# Altium project Motherboard.PrjPcb
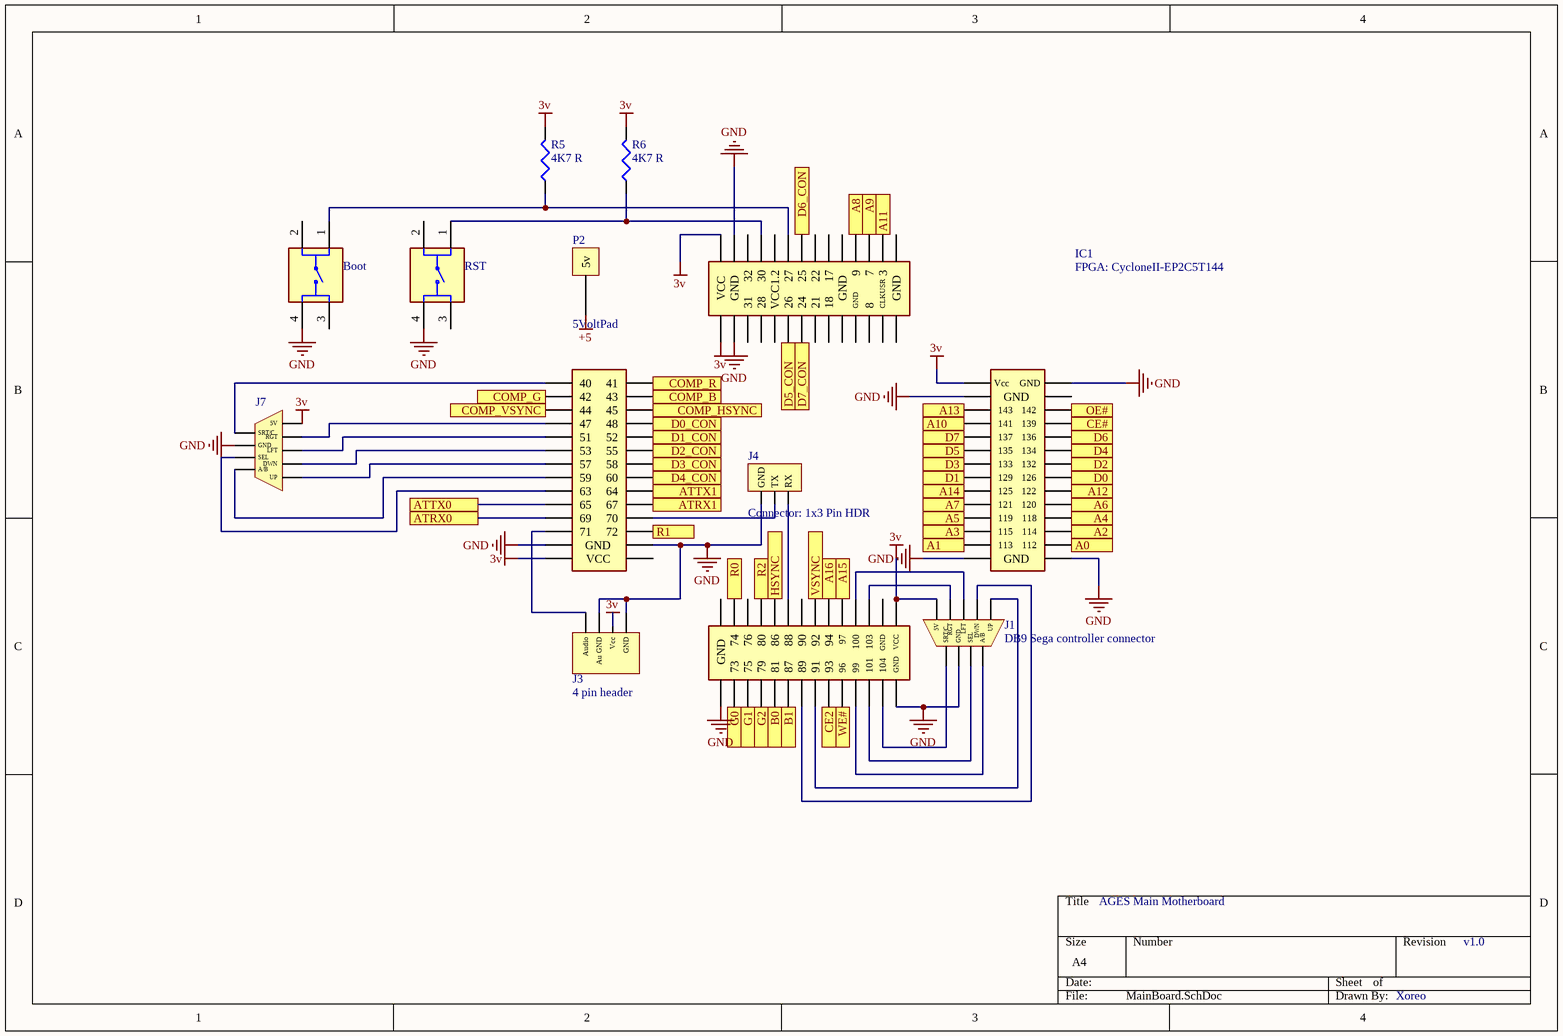
[diagram p0: MainBoard.SchDoc]
6 sheets, 38 parts. Net scope: flat (ports and power ports of the same name join across sheets).
Board file: AGES_PBC.PcbDoc
Sheets:
  MainBoard.SchDoc
  RAMConnection.SchDoc
  VGAConnection.SchDoc
  SDConnection.SchDoc
  CompositeConnection.SchDoc
  DebugLEDs.SchDoc

## Sheet MainBoard.SchDoc
size A4; SheetNumber: 1; SheetTotal: 6

### Parts
Boot  Button  [Button]  (value not drawn)
IC1  FPGA: CycloneII-EP2C5T144  [Cyclone II]
J1  DB9 Sega controller connector  [DB9 Connector]
J3  4 pin header  [4 HDR]
J4  Connector: 1x3 Pin HDR  [3 HDR]
J7  DB9 Sega controller connector  [DB9 Connector]  (value not drawn)
P2  5VoltPad  [5VoltPad]
R5  4K7 R  [Resistor 0603]
R6  4K7 R  [Resistor 0603]
RST  Button  [Button]  (value not drawn)

### Ports
A0, A1, A2, A3, A4, A5, A6, A7, A8, A9, A10, A11, A12, A13, A14, A15, A16, ATRX0, ATRX1, ATTX0, ATTX1, B0, B1, CE2, CE#, COMP_B, COMP_G, COMP_HSYNC, COMP_R, COMP_VSYNC, D0, D0_CON, D1, D1_CON, D2, D2_CON, D3, D3_CON, D4, D4_CON, D5, D5_CON, D6, D6_CON, D7, D7_CON, G0, G1, G2, HSYNC, OE#, R0, R1, R2, VSYNC, WE#

### Nets
3v: IC1.27(VCC) IC1.28(VCC) IC1.55 IC1.57(VCC) IC1.86(Vcc) J1.5(5V) J3.2(Vcc) J7.5(5V) R5.2 R6.2
+5: P2.1(5v)
GND: Boot.4 IC1.25(GND) IC1.26(GND) IC1.53 IC1.54(GND) IC1.58(GND) IC1.84(GND) IC1.85(GND) IC1.88 IC1.111(GND) IC1.112 J1.8(GND) J3.1(GND) J3.3(Au_GND) J4.1(GND) J7.8(GND) RST.4
NetBoot_1: Boot.1 IC1.17(27) R5.1
NetIC1_3: IC1.3 ; port A11
NetIC1_5: IC1.5(7) ; port A9
NetIC1_7: IC1.7(9) ; port A8
NetIC1_15: IC1.15(25) ; port D6_CON
NetIC1_16: IC1.16(24) ; port D7_CON
NetIC1_18: IC1.18(26) ; port D5_CON
NetIC1_21: IC1.21(30) R6.1 RST.1
NetIC1_29: IC1.29(40) J7.9(SRT/C)
NetIC1_30: IC1.30(41) ; port COMP_R
NetIC1_31: IC1.31(42) ; port COMP_G
NetIC1_32: IC1.32(43) ; port COMP_B
NetIC1_33: IC1.33(44) ; port COMP_VSYNC
NetIC1_34: IC1.34(45) ; port COMP_HSYNC
NetIC1_35: IC1.35(47) J7.4(RGT)
NetIC1_36: IC1.36(48) ; port D0_CON
NetIC1_37: IC1.37(51) J7.3(LFT)
NetIC1_38: IC1.38(52) ; port D1_CON
NetIC1_39: IC1.39(53) J7.2(DWN)
NetIC1_40: IC1.40(55) ; port D2_CON
NetIC1_41: IC1.41(57) J7.1(UP)
NetIC1_42: IC1.42(58) ; port D3_CON
NetIC1_43: IC1.43(59) J7.6(A/B)
NetIC1_44: IC1.44(60) ; port D4_CON
NetIC1_45: IC1.45(63) J7.7(SEL)
NetIC1_46: IC1.46(64) ; port ATTX1
NetIC1_47: IC1.47(65) ; port ATTX0
NetIC1_48: IC1.48(67) ; port ATRX1
NetIC1_49: IC1.49(69) ; port ATRX0
NetIC1_50: IC1.50(70) J4.2(TX)
NetIC1_51: IC1.51(71) J3.4(Audio)
NetIC1_52: IC1.52(72) ; port R1
NetIC1_60: IC1.60(104) J1.9(SRT/C)
NetIC1_61: IC1.61(103) J1.4(RGT)
NetIC1_62: IC1.62(101) J1.7(SEL)
NetIC1_63: IC1.63(100) J1.3(LFT)
NetIC1_64: IC1.64(99) J1.6(A/B)
NetIC1_65: IC1.65(97) ; port A15
NetIC1_66: IC1.66(96) ; port WE#
NetIC1_67: IC1.67(94) ; port A16
NetIC1_68: IC1.68(93) ; port CE2
NetIC1_69: IC1.69(92) ; port VSYNC
NetIC1_70: IC1.70(91) J1.1(UP)
NetIC1_72: IC1.72(89) J1.2(DWN)
NetIC1_73: IC1.73(88) J4.3(RX)
NetIC1_74: IC1.74(87) ; port B1
NetIC1_75: IC1.75(86) ; port HSYNC
NetIC1_76: IC1.76(81) ; port B0
NetIC1_77: IC1.77(80) ; port R2
NetIC1_78: IC1.78(79) ; port G2
NetIC1_80: IC1.80(75) ; port G1
NetIC1_81: IC1.81(74) ; port R0
NetIC1_82: IC1.82(73) ; port G0
NetIC1_89: IC1.89(142) ; port OE#
NetIC1_90: IC1.90(143) ; port A13
NetIC1_91: IC1.91(139) ; port CE#
NetIC1_92: IC1.92(141) ; port A10
NetIC1_93: IC1.93(136) ; port D6
NetIC1_94: IC1.94(137) ; port D7
NetIC1_95: IC1.95(134) ; port D4
NetIC1_96: IC1.96(135) ; port D5
NetIC1_97: IC1.97(132) ; port D2
NetIC1_98: IC1.98(133) ; port D3
NetIC1_99: IC1.99(126) ; port D0
NetIC1_100: IC1.100(129) ; port D1
NetIC1_101: IC1.101(122) ; port A12
NetIC1_102: IC1.102(125) ; port A14
NetIC1_103: IC1.103(120) ; port A6
NetIC1_104: IC1.104(121) ; port A7
NetIC1_105: IC1.105(118) ; port A4
NetIC1_106: IC1.106(119) ; port A5
NetIC1_107: IC1.107(114) ; port A2
NetIC1_108: IC1.108(115) ; port A3
NetIC1_109: IC1.109(112) ; port A0
NetIC1_110: IC1.110(113) ; port A1

Not connected (* = marked no-connect by the designer): Boot 2 3; IC1 1(GND) 2(GND) 4(CLKUSR) 6(8) 8(GND) 9(GND) 10(GND) 11(17) 12(18) 13(22) 14(21) 19(VCC1.2) 20(VCC1.2) 22(28) 23(32) 24(31) 56(VCC) 59(GND) 71(90) 79(76) 83(VCC) 87(GND); RST 2 3

### Notes on the sheet
- AGES Main Motherboard
- v1.0
- Xoreo

### Library data of the parts
Boot RST = Button: 50 mA SPST Round Actuator 160 Gram Force Tactile Pushbutton Switch; MP: 1825910-2; MF: TE Connectivity; Check_prices: https://www.snapeda.com/parts/1825910-2/TE+Connectivity+ALCOSWITCH+Switches/view-part/?ref=eda; Value: *; Availability: In Stock; Price: None; Package: None; SnapEDA_Link: https://www.snapeda.com/parts/1825910-2/TE+Connectivity+ALCOSWITCH+Switches/view-part/?ref=snap; Purchase-URL: https://pricing.snapeda.com/search/part/1825910-2/?ref=eda; EU_RoHS_Compliance: Compliant
J1 J7 = Connector: DB9: 9 Way Right Angle Through Hole PCB D-sub Connector Socket; 2.77mm; 2.84mm Pitch; Manufacturer: Wurth Electronics; Manufacturer Part Number: 618009231321; Gender: Female; Current Rating: 3A; Number of Contacts: 9; Voltage Rating: 125V; Supplier 1: Farnell; RoHS: Yes; Category: D-Sub Connectors; Stock 1: 287; Pricing 1: 1=3,44000, 10=2,90000, 100=2,52000, 250=2,17000, 500=1,93000, 1000=1,89000 (EUR); Mount: Through Hole; Contact Material: Copper Alloy; Contact Plating: Gold; Housing Material: Steel; Min Operating Temperature: -40°C; Max Operating Temperature: 85°C; Series: 618; Number of Rows: 2; Termination: SMD/SMT; Orientation: Right Angle; Length: 30.8mm; Width: 12.5mm; Depth: 20.75mm; Pitch: 2.84mm; RoHS Compliant: Yes; Lead Free: Lead Free; ComponentLink1URL: https://datasheet.ciiva.com/25605/0900766b81191772-25605489.pdf?src-supplier=Rs; ComponentLink1Description: https://datasheet.ciiva.com/25605/0900766b81191772-25605489.pdf?src-supplier=Rs; ComponentLink2URL: https://datasheet.ciiva.com/12669/6180xx231321-12669192.pdf?src-supplier=Mouser; ComponentLink2Description: https://datasheet.ciiva.com/12669/6180xx231321-12669192.pdf?src-supplier=Mouser; Supplier Part Number 1: 1841197
J3 = Connector: 4 pin header: Male 4 pin header
R5 R6 = Resistor: 4K7: Surface Mount Metal Film Resistor, Pcf Series, 4.7 Kohm, 63 Mw, - 0.1%, 75 V Rohs Compliant: Yes; Manufacturer: TT Welwyn; Manufacturer Part Number: PCF0603P-R-4K7-BT1; Power Rating: 63mW; Voltage Rating: 75V; Resistance: 4.7kR; Temperature Coefficient: 25ppm/°C; Case/Category: 0603; Supplier 1: Newark; RoHS: Yes; Category: Chip SMD Resistors; Stock 1: 1027; Pricing 1: 10=0,17900 (USD); Case Code (Imperial): 0603; Case Code (Metric): 1608; Tolerance: 0.1%; Packaging: Cut Tape; Resistor Type: Thin Film; Voltage Rating (DC): 75V; REACH SVHC: No SVHC; ComponentLink1URL: https://datasheet.ciiva.com/7860/3754-7860191.pdf?src-supplier=Element14; ComponentLink1Description: https://datasheet.ciiva.com/7860/3754-7860191.pdf?src-supplier=Element14; ComponentLink2URL: https://datasheet.ciiva.com/6093/3754-6093381.pdf?src-supplier=Farnell; ComponentLink2Description: https://datasheet.ciiva.com/6093/3754-6093381.pdf?src-supplier=Farnell; Supplier Part Number 1: 61M8292

## Sheet RAMConnection.SchDoc
size A4; SheetNumber: 2; SheetTotal: 6
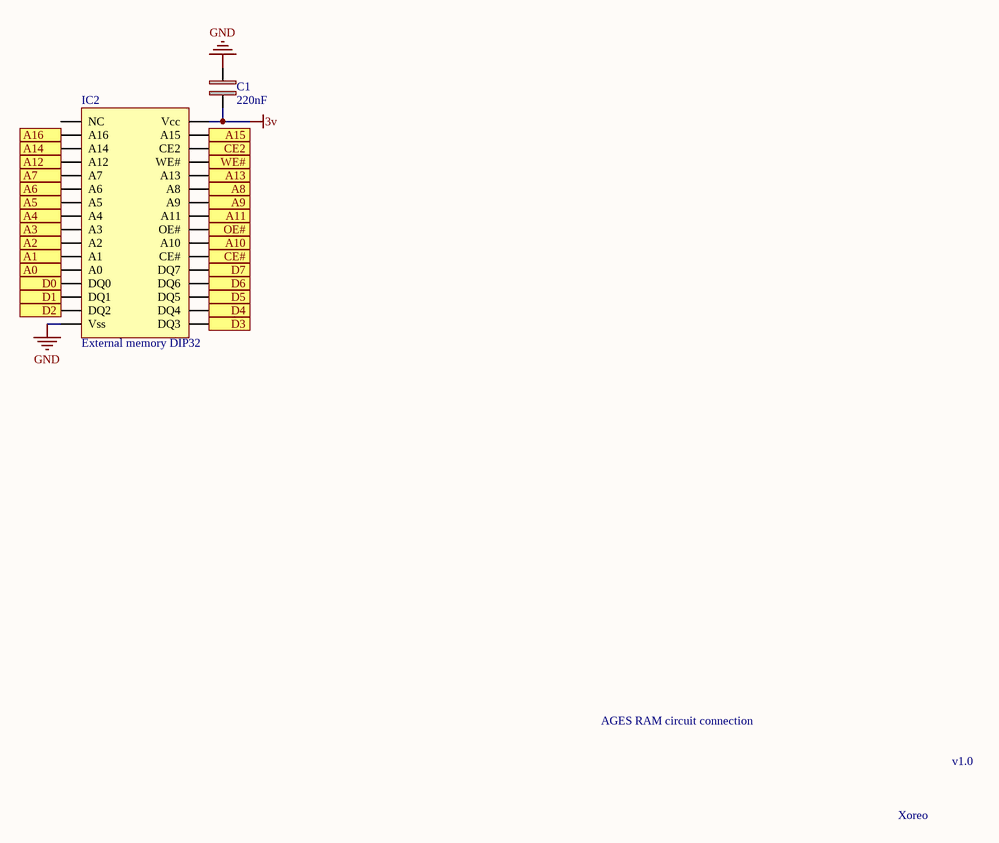
[diagram p1: RAMConnection.SchDoc]

### Parts
C1  220nF  [C0805C224K5RACTU]
IC2  External memory DIP32  [DIP32 HDR]

### Ports
A0, A1, A2, A3, A4, A5, A6, A7, A8, A9, A10, A11, A12, A13, A14, A15, A16, CE2, CE#, D0, D1, D2, D3, D4, D5, D6, D7, OE#, WE#

### Nets
3v: C1.2 IC2.32(Vcc)
GND: C1.1 IC2.16(Vss)
NetIC1_3: IC2.25(A11) ; port A11
NetIC1_5: IC2.26(A9) ; port A9
NetIC1_7: IC2.27(A8) ; port A8
NetIC1_65: IC2.31(A15) ; port A15
NetIC1_66: IC2.29(WE#) ; port WE#
NetIC1_67: IC2.2(A16) ; port A16
NetIC1_68: IC2.30(CE2) ; port CE2
NetIC1_89: IC2.24(OE#) ; port OE#
NetIC1_90: IC2.28(A13) ; port A13
NetIC1_91: IC2.22(CE#) ; port CE#
NetIC1_92: IC2.23(A10) ; port A10
NetIC1_93: IC2.20(DQ6) ; port D6
NetIC1_94: IC2.21(DQ7) ; port D7
NetIC1_95: IC2.18(DQ4) ; port D4
NetIC1_96: IC2.19(DQ5) ; port D5
NetIC1_97: IC2.15(DQ2) ; port D2
NetIC1_98: IC2.17(DQ3) ; port D3
NetIC1_99: IC2.13(DQ0) ; port D0
NetIC1_100: IC2.14(DQ1) ; port D1
NetIC1_101: IC2.4(A12) ; port A12
NetIC1_102: IC2.3(A14) ; port A14
NetIC1_103: IC2.6(A6) ; port A6
NetIC1_104: IC2.5(A7) ; port A7
NetIC1_105: IC2.8(A4) ; port A4
NetIC1_106: IC2.7(A5) ; port A5
NetIC1_107: IC2.10(A2) ; port A2
NetIC1_108: IC2.9(A3) ; port A3
NetIC1_109: IC2.12(A0) ; port A0
NetIC1_110: IC2.11(A1) ; port A1

Not connected (* = marked no-connect by the designer): IC2 1(NC)

### Notes on the sheet
- AGES RAM circuit connection
- v1.0
- Xoreo

### Library data of the parts
C1 = Capacitor: 0.22µF: 0805 C 220nF Ceramic Multilayer Capacitor; 50 VDC; +125degC; X7R Dielec; +/-10%; Manufacturer: KEMET; Voltage Rating: 50V; Tolerance: 10%; Dissipation Factor: 2.5%; Supplier 1: RSComponents; Manufacturer Part Number: C0805C224K5RACTU; RoHS: Yes; Category: Ceramic Capacitors; Stock 1: 18500; Pricing 1: 500=0,04800, 2500=0,03900 (USD); Mount: Surface Mount,PCB; Case/Package: 0805; Case Code (Metric): 2012; Case Code (Imperial): 0805; Dielectric Material: Ceramic; Min Operating Temperature: -55°C; Max Operating Temperature: 125°C; Package Quantity: 1; Capacitance: 220nF; Packaging: Tape and Reel; Voltage Rating (DC): 50V; Dielectric: X7R; Termination: SMD/SMT; Voltage: 50V; Series: C; Construction: Flat; Length: 2mm; Width: 0.049inch; Height: 1.1mm; Thickness: 0.055inch; Lead Pitch: 0.75mm; Depth: 1.25mm; Radiation Hardening: No; REACH SVHC: No SVHC; RoHS Compliant: Yes; ComponentLink1URL: https://datasheet.ciiva.com/7842/kem-c1002-x7r-smd-7842582.pdf?src-supplier=Element14; ComponentLink1Description: https://datasheet.ciiva.com/7842/kem-c1002-x7r-smd-7842582.pdf?src-supplier=Element14; ComponentLink2URL: https://datasheet.ciiva.com/18193/getdatasheetpartid-304413-18193686.pdf?src-supplier=Verical; ComponentLink2Description: https://datasheet.ciiva.com/18193/getdatasheetpartid-304413-18193686.pdf?src-supplier=Verical; Supplier Part Number 1: 8029927
IC2 = IC: AS6C1008: AS6C1008 Series 1-Mbit (128 K x 8) 3 V 55 ns CMOS Static RAM - PDIP-32; Manufacturer: Alliance Memory; Manufacturer Part Number: AS6C1008-55PCN; Access Time: 55ns; Max Supply Voltage: 5.5V; Min Supply Voltage: 2.7V; Interface: Parallel; Memory Size: 1Mb; Memory Type: RAM,SRAM - Asynchronous,SDR; Operating Supply Voltage: 3V; Address Bus Width: 17b; Number of Ports: 1; Number of Words: 128000; Max Supply Current: 60mA; Supplier 1: Rs; RoHS: Yes; Category: RAM; Stock 1: 774; Pricing 1: 1=4,11000, 5=3,49000, 10=3,39000, 25=3,28000, 50=3,20000 (EUR); Mount: Through Hole; Case/Package: PDIP; Number of Pins: 32; Weight: 0.078125oz; Min Operating Temperature: 0°C; Max Operating Temperature: 70°C; Packaging: Rail/Tube; Package Quantity: 13; Series: AS6C1008; Density: 1Mb; Access Time-Max: 55ns; Supply Voltage-Nom: 3V; Length: 41.91mm; Width: 13.818mm; Height: 3.81mm; Radiation Hardening: No; RoHS Compliant: Yes; Lead Free: Lead Free; Temperature Grade: COMMERCIAL; Reach SVHC Compliant: Yes; ComponentLink1URL: https://datasheet.ciiva.com/19457/1927457-19457052.pdf?src-supplier=Jameco; ComponentLink1Description: https://datasheet.ciiva.com/19457/1927457-19457052.pdf?src-supplier=Jameco; ComponentLink2URL: https://datasheet.ciiva.com/6877/32783-6877594.pdf?src-supplier=Newark; ComponentLink2Description: https://datasheet.ciiva.com/6877/32783-6877594.pdf?src-supplier=Newark; ComponentLink3URL: https://datasheet.ciiva.com/18617/as6c1008feb2007-18617960.pdf?src-supplier=Digi-Key; ComponentLink3Description: https://datasheet.ciiva.com/18617/as6c1008feb2007-18617960.pdf?src-supplier=Digi-Key; ComponentLink4URL: https://datasheet.ciiva.com/1510/32783-1510620.pdf?src-supplier=Element14; ComponentLink4Description: https://datasheet.ciiva.com/1510/32783-1510620.pdf?src-supplier=Element14; ComponentLink5URL: https://datasheet.ciiva.com/3201/as6c1008feb2007-3201030.pdf?src-supplier=Avnet; ComponentLink5Description: https://datasheet.ciiva.com/3201/as6c1008feb2007-3201030.pdf?src-supplier=Avnet; ComponentLink6URL: https://datasheet.ciiva.com/16208/as6c1008feb2007-16208749.pdf?src-supplier=Future+Electronics; ComponentLink6Description: https://datasheet.ciiva.com/16208/as6c1008feb2007-16208749.pdf?src-supplier=Future+Electronics; Supplier Part Number 1: 7444542

## Sheet VGAConnection.SchDoc
size A4; SheetNumber: 3; SheetTotal: 6
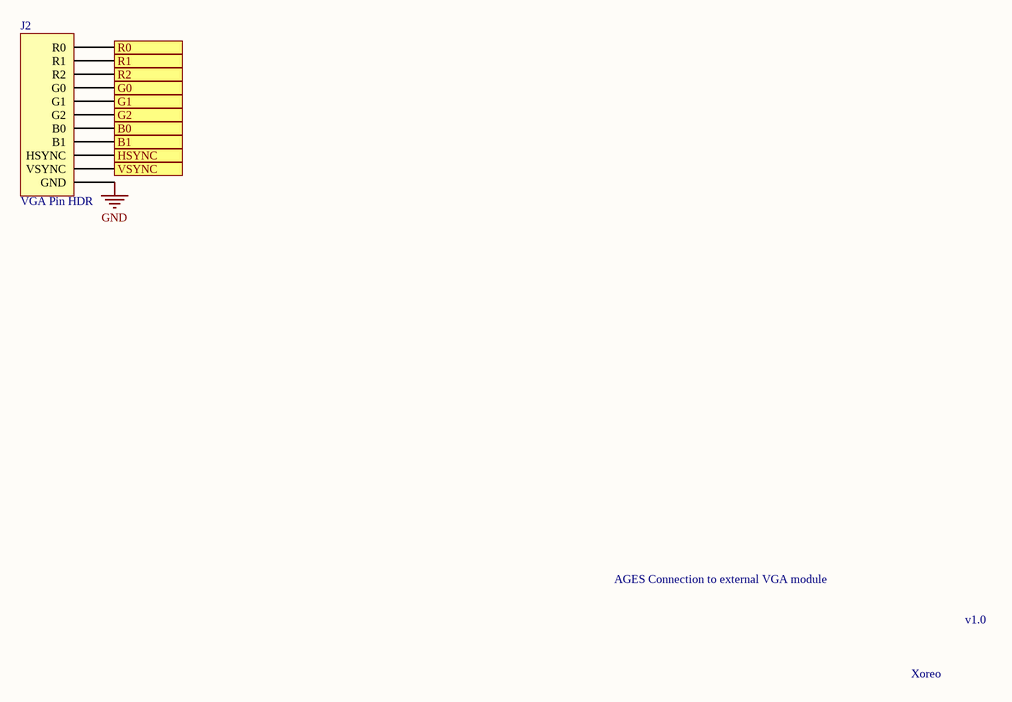
[diagram p2: VGAConnection.SchDoc]

### Parts
J2  VGA Pin HDR  [VGA HDR]

### Ports
B0, B1, G0, G1, G2, HSYNC, R0, R1, R2, VSYNC

### Nets
GND: J2.11(GND)
NetIC1_52: J2.2(R1) ; port R1
NetIC1_69: J2.10(VSYNC) ; port VSYNC
NetIC1_74: J2.8(B1) ; port B1
NetIC1_75: J2.9(HSYNC) ; port HSYNC
NetIC1_76: J2.7(B0) ; port B0
NetIC1_77: J2.3(R2) ; port R2
NetIC1_78: J2.6(G2) ; port G2
NetIC1_80: J2.5(G1) ; port G1
NetIC1_81: J2.1(R0) ; port R0
NetIC1_82: J2.4(G0) ; port G0

### Notes on the sheet
- AGES Connection to external VGA module
- v1.0
- Xoreo

### Library data of the parts
J2 = Connector: VGA HDR: VGA pin male header

## Sheet SDConnection.SchDoc
size A4; SheetNumber: 4; SheetTotal: 6
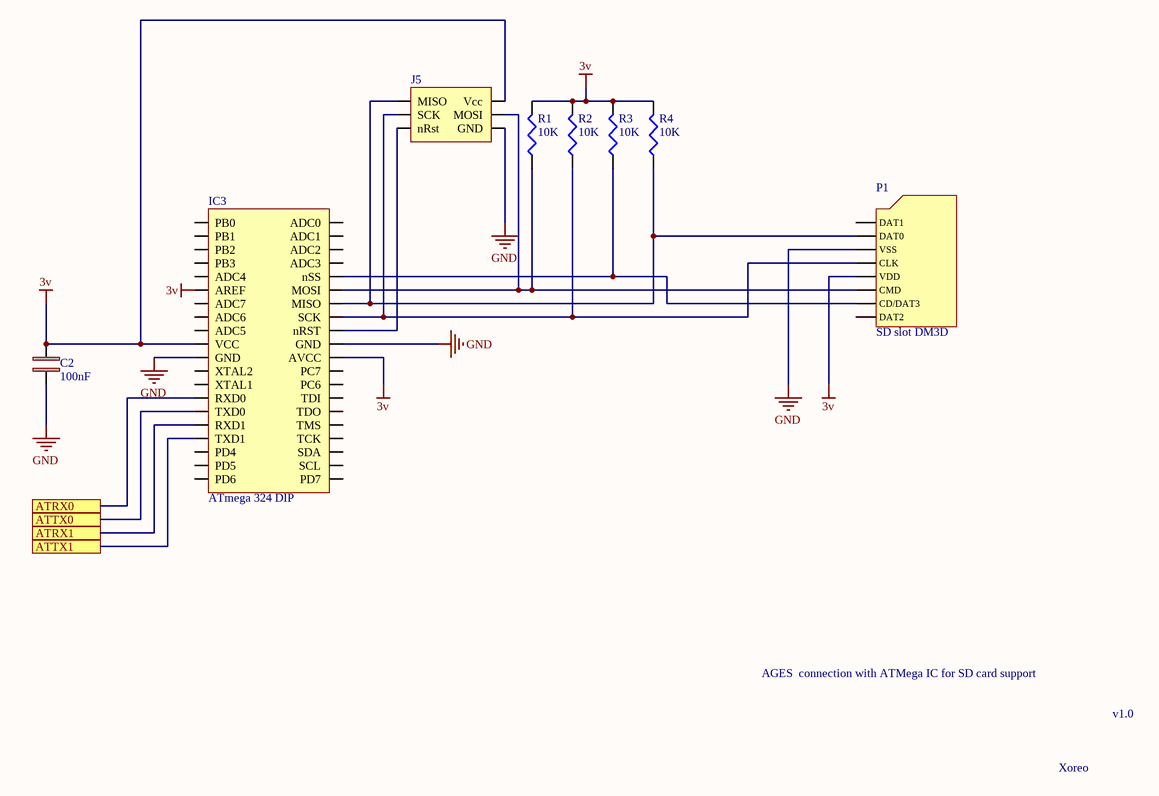
[diagram p3: SDConnection.SchDoc]

### Parts
C2  100nF  [CAPACITOR 1206]
IC3  ATmega 324 DIP  [DIP40 HDR]
J5  2x3 male pin header  [2X3 HDR]  (value not drawn)
P1  SD slot DM3D  [SD SLOT]
R1  10K  [RESISTOR 0805]
R2  10K  [RESISTOR 0805]
R3  10K  [RESISTOR 0805]
R4  10K  [RESISTOR 0805]

### Ports
ATRX0, ATRX1, ATTX0, ATTX1

### Nets
3v: C2.1 IC3.10(VCC) IC3.30(AVCC) IC3.32(AREF) J5.2(Vcc) P1.4(VDD) R1.2 R2.2 R3.2 R4.2
GND: C2.2 IC3.11(GND) IC3.31(GND) J5.6(GND) P1.6(VSS)
NetIC1_46: IC3.17(TXD1) ; port ATTX1
NetIC1_47: IC3.15(TXD0) ; port ATTX0
NetIC1_48: IC3.16(RXD1) ; port ATRX1
NetIC1_49: IC3.14(RXD0) ; port ATRX0
NetIC3_5: IC3.5(nSS) P1.2(CD/DAT3) R3.1
NetIC3_6: IC3.6(MOSI) J5.4(MOSI) P1.3(CMD) R1.1
NetIC3_7: IC3.7(MISO) J5.1(MISO) P1.7(DAT0) R4.1
NetIC3_8: IC3.8(SCK) J5.3(SCK) P1.5(CLK) R2.1
NetIC3_9: IC3.9(nRST) J5.5(nRst)

Not connected (* = marked no-connect by the designer): IC3 1(PB0) 2(PB1) 3(PB2) 4(PB3) 12(XTAL2) 13(XTAL1) 18(PD4) 19(PD5) 20(PD6) 21(PD7) 22(SCL) 23(SDA) 24(TCK) 25(TMS) 26(TDO) 27(TDI) 28(PC6) 29(PC7) 33(ADC7) 34(ADC6) 35(ADC5) 36(ADC4) 37(ADC3) 38(ADC2) 39(ADC1) 40(ADC0); P1 1(DAT2) 8(DAT1)

### Notes on the sheet
- AGES  connection with ATMega IC for SD card support
- v1.0
- Xoreo

### Library data of the parts
C2 = Capacitor: 100nF: Ceramic capacitor SMD-1206 100nF /50V X7R# K +-10%, AVX, RoHS, /4000 reel/; Manufacturer: Kyocera AVX; Manufacturer Part Number: 12065C104KAT2A; Tolerance: 10%; Voltage Rating: 50V; Dielectric: X7R; Insulation Resistance: 100GR; Dissipation Factor: 2.5%; Supplier 1: Farnell; RoHS: Yes; Category: Ceramic Capacitors; Stock 1: 188000; Pricing 1: 4000=0,02600, 20000=0,02520, 40000=0,02440 (EUR); Mount: Surface Mount,PCB; Case/Package: 1206; Number of Pins: 2; Case Code (Metric): 3216; Case Code (Imperial): 1206; Dielectric Material: Ceramic; Contact Plating: Tin,Matte; Min Operating Temperature: -55°C; Max Operating Temperature: 125°C; Packaging: Tape and Reel; Capacitance: 100nF; Voltage Rating (DC): 50V; Voltage: 50V; Series: -; Package Quantity: 1; Termination: SMD/SMT; Construction: Flat; Length: 3.2mm; Width: 1.6mm; Height: 0.94mm; Depth: 1.6mm; Thickness: 0.037inch; Radiation Hardening: No; Lead Free: Lead Free; RoHS Compliant: Yes; Reach SVHC Compliant: Yes; ComponentLink1URL: https://datasheet.ciiva.com/11786/0900766b80ed4be2-11786988.pdf?src-supplier=Rs; ComponentLink1Description: https://datasheet.ciiva.com/11786/0900766b80ed4be2-11786988.pdf?src-supplier=Rs; ComponentLink2URL: https://datasheet.ciiva.com/2988/cx7r-2988135.pdf?src-supplier=Avnet; ComponentLink2Description: https://datasheet.ciiva.com/2988/cx7r-2988135.pdf?src-supplier=Avnet; ComponentLink3URL: https://datasheet.ciiva.com/16375/cx7r-16375719.pdf?src-supplier=Future+Electronics; ComponentLink3Description: https://datasheet.ciiva.com/16375/cx7r-16375719.pdf?src-supplier=Future+Electronics; ComponentLink4URL: https://datasheet.ciiva.com/2988/cx7r-2988136.pdf?src-supplier=Avnet; ComponentLink4Description: https://datasheet.ciiva.com/2988/cx7r-2988136.pdf?src-supplier=Avnet; ComponentLink5URL: https://datasheet.ciiva.com/7833/cx7r-7833405.pdf?src-supplier=Element14; ComponentLink5Description: https://datasheet.ciiva.com/7833/cx7r-7833405.pdf?src-supplier=Element14; ComponentLink6URL: https://datasheet.ciiva.com/25796/cx7r-25796358.pdf?src-supplier=Farnell; ComponentLink6Description: https://datasheet.ciiva.com/25796/cx7r-25796358.pdf?src-supplier=Farnell; ComponentLink7URL: https://datasheet.ciiva.com/7833/cx7r-7833402.pdf?src-supplier=Element14; ComponentLink7Description: https://datasheet.ciiva.com/7833/cx7r-7833402.pdf?src-supplier=Element14; ComponentLink8URL: https://datasheet.ciiva.com/150/cx7r-150390.pdf?src-supplier=Digi-Key; ComponentLink8Description: https://datasheet.ciiva.com/150/cx7r-150390.pdf?src-supplier=Digi-Key; ComponentLink9URL: https://datasheet.ciiva.com/150/cx7r-150389.pdf?src-supplier=Digi-Key; ComponentLink9Description: https://datasheet.ciiva.com/150/cx7r-150389.pdf?src-supplier=Digi-Key; ComponentLink10URL: https://datasheet.ciiva.com/150/cx7r-150391.pdf?src-supplier=Digi-Key; ComponentLink10Description: https://datasheet.ciiva.com/150/cx7r-150391.pdf?src-supplier=Digi-Key; ComponentLink11URL: https://datasheet.ciiva.com/7833/cx7r-7833403.pdf?src-supplier=Element14; ComponentLink11Description: https://datasheet.ciiva.com/7833/cx7r-7833403.pdf?src-supplier=Element14; ComponentLink12URL: https://datasheet.ciiva.com/7833/cx7r-7833404.pdf?src-supplier=Element14; ComponentLink12Description: https://datasheet.ciiva.com/7833/cx7r-7833404.pdf?src-supplier=Element14; ComponentLink13URL: https://datasheet.ciiva.com/5415/cx7r-218113-5415909.pdf?src-supplier=Mouser; ComponentLink13Description: https://datasheet.ciiva.com/5415/cx7r-218113-5415909.pdf?src-supplier=Mouser; ComponentLink14URL: https://datasheet.ciiva.com/14584/70001075-14584956.pdf?src-supplier=Allied+Electronics; ComponentLink14Description: https://datasheet.ciiva.com/14584/70001075-14584956.pdf?src-supplier=Allied+Electronics; Supplier Part Number 1: 2281081
IC3 = IC: ATmega324: 8-bit AVR MCU, 32 KB, 2048 Bytes, 20 MHz, 1.8 to 5.5V, PDIP-40, RoHS; Manufacturer: Microchip; Manufacturer Part Number: ATMEGA324PA-PU; Min Supply Voltage: 1.8V; Interface: I2C,SPI,UART,USART,2-Wire; Frequency: 20MHz; RAM Size: 2KB; Number of I/Os: 32; Number of Timers/Counters: 3; Oscillator Type: Internal; Data Bus Width: 8b; Watchdog Timer: Yes; Memory Type: FLASH; Memory Size: 32KB; Peripherals: Brown-out Detect/Reset,POR,PWM,WDT; Number of PWM Channels: 6; Number of ADC Channels: 8; Number of SPI Channels: 1; Supplier 1: Farnell; RoHS: Yes; Category: Uncategorized; Stock 1: 132; Pricing 1: 1=5,70000, 25=5,22000, 100=5,13000 (EUR); Mount: Through Hole; Case/Package: PDIP; Number of Pins: 40; Contact Plating: Tin,Matte; Min Operating Temperature: -40°C; Max Operating Temperature: 85°C; Max Supply Voltage: 5.5V; Package Quantity: 10; Packaging: Rail/Tube; Number of Programmable I/O: 32; Max Frequency: 20MHz; Core Architecture: AVR; Series: AVR® ATmega; Number of I2C Channels: 1; Length: 52.58mm; Width: 13.97mm; Height: 4.445mm; RoHS Compliant: Yes; Reach SVHC Compliant: Yes; ComponentLink1URL: https://datasheet.ciiva.com/1157/atmel-8272-8-bit-avr-microcontroller-atmega164a-pa-324a-pa-644a-pa-1284-p-summary-1157584.pdf?src-supplier=Element14; ComponentLink1Description: https://datasheet.ciiva.com/1157/atmel-8272-8-bit-avr-microcontroller-atmega164a-pa-324a-pa-644a-pa-1284-p-summary-1157584.pdf?src-supplier=Element14; ComponentLink2URL: https://datasheet.ciiva.com/9234/doc8272-9234746.pdf?src-supplier=Avnet; ComponentLink2Description: https://datasheet.ciiva.com/9234/doc8272-9234746.pdf?src-supplier=Avnet; Supplier Part Number 1: 1715485
J5 = Connector: 2x3 Pin: 2x3 Pin header
P1 = SD slot: Memory Card Connectors MICRO SD CD CONN STD SMT PUSHPULL; Manufacturer: Hirose; Manufacturer Part Number: DM3D-SF; Gender: Female; Contact Resistance: 100mR; Current Rating: 500mA; Voltage Rating (AC): 125V; Number of Contacts: 8; Insulation Resistance: 1GR; Pitch: 1.1mm; Supplier 1: Farnell; RoHS: Yes; Category: Memory Connectors; Stock 1: 7247; Pricing 1: 1=1,80000, 10=1,48000, 100=1,28000, 500=1,18000, 1000=0,93700, 2500=0,91800 (EUR); Mount: Surface Mount; Contact Material: Copper Alloy,Copper; Contact Plating: Gold; Housing Material: Polymer; Min Operating Temperature: -25°C; Max Operating Temperature: 85°C; Number of Rows: 1; Package Quantity: 1; Packaging: Tape and Reel; Max Current Rating: 500mA; Connector Type: Connector; Termination: Solder; Orientation: Right Angle; Series: DM3; Max Voltage Rating (AC): 125V; Length: 11.95mm; Width: 11.95mm; Depth: 11.45mm; Radiation Hardening: No; Lead Free: Lead Free; Flammability Rating: UL94 V-0; RoHS Compliant: Yes; Reach SVHC Compliant: Yes; ComponentLink1URL: https://datasheet.ciiva.com/1105/1697167-1105105.pdf?src-supplier=Element14; ComponentLink1Description: https://datasheet.ciiva.com/1105/1697167-1105105.pdf?src-supplier=Element14; ComponentLink2URL: https://datasheet.ciiva.com/11755/0900766b80fd13c1-11755152.pdf?src-supplier=Rs; ComponentLink2Description: https://datasheet.ciiva.com/11755/0900766b80fd13c1-11755152.pdf?src-supplier=Rs; ComponentLink3URL: https://datasheet.ciiva.com/16287/e60900232-16287615.pdf?src-supplier=Future+Electronics; ComponentLink3Description: https://datasheet.ciiva.com/16287/e60900232-16287615.pdf?src-supplier=Future+Electronics; ComponentLink4URL: https://datasheet.ciiva.com/15174/getdatasheetpartid-432464-15174822.pdf?src-supplier=Verical; ComponentLink4Description: https://datasheet.ciiva.com/15174/getdatasheetpartid-432464-15174822.pdf?src-supplier=Verical; ComponentLink5URL: https://datasheet.ciiva.com/3122/e60900232-3122537.pdf?src-supplier=Avnet; ComponentLink5Description: https://datasheet.ciiva.com/3122/e60900232-3122537.pdf?src-supplier=Avnet; ComponentLink6URL: https://datasheet.ciiva.com/683/e60900232-683362.pdf?src-supplier=Digi-Key; ComponentLink6Description: https://datasheet.ciiva.com/683/e60900232-683362.pdf?src-supplier=Digi-Key; ComponentLink7URL: https://datasheet.ciiva.com/683/e60900232-683363.pdf?src-supplier=Digi-Key; ComponentLink7Description: https://datasheet.ciiva.com/683/e60900232-683363.pdf?src-supplier=Digi-Key; ComponentLink8URL: https://datasheet.ciiva.com/683/e60900232-683364.pdf?src-supplier=Digi-Key; ComponentLink8Description: https://datasheet.ciiva.com/683/e60900232-683364.pdf?src-supplier=Digi-Key; ComponentLink9URL: https://datasheet.ciiva.com/22627/1697167-22627974.pdf?src-supplier=Farnell; ComponentLink9Description: https://datasheet.ciiva.com/22627/1697167-22627974.pdf?src-supplier=Farnell; Supplier Part Number 1: 1764377
R1-R4 = Resistor: 10K R: Res Thick Film 0805 10K Ohm 5% 1/8W ±200ppm/°C Molded SMD SMD Paper T/R; Manufacturer: Vishay Dale; Manufacturer Part Number: CRCW080510K0JNEB; Resistance: 10kR; Power Rating: 125mW; Voltage Rating: 150V; Supplier 1: Avnet; RoHS: Yes; Category: Chip SMD Resistors; Stock 1: 90000; Pricing 1: 10000=0,02220, 20000=0,02100, 40000=0,01980, 60000=0,01860, 80000=0,01740, 100000=0,01620, 1000000=0,01500 (USD); Case/Package: 0805; Case Code (Imperial): 0805; Case Code (Metric): 2012; Contact Plating: Tin; Weight: 0.000194oz; Min Operating Temperature: -55°C; Max Operating Temperature: 155°C; Packaging: Tape and Reel; Tolerance: 5%; Resistor Type: Thick Film; Temperature Coefficient: 200ppm/°C; Series: CRCW; Max Power Dissipation: 125mW; Number of Terminations: 2; Termination: SMD/SMT; Package Quantity: 10000; Voltage Rating (DC): 150V; Features: Automotive AEC-Q200; Resistance Tolerance: 5%; Construction: Rectangular; Technology: THICK FILM; Working Voltage: 150V; Length: 0.079inch; Width: 1.25mm; Height: 0.02inch; Depth: 1.25mm; Radiation Hardening: No; RoHS Compliant: Yes; Lead Free: Lead Free; Military Standard: Not; ComponentLink1URL: https://datasheet.ciiva.com/16199/dcrcwe3-16199191.pdf?src-supplier=Future+Electronics; ComponentLink1Description: https://datasheet.ciiva.com/16199/dcrcwe3-16199191.pdf?src-supplier=Future+Electronics; ComponentLink2URL: https://datasheet.ciiva.com/7725/dcrcwe3-7725772.pdf?src-supplier=Element14; ComponentLink2Description: https://datasheet.ciiva.com/7725/dcrcwe3-7725772.pdf?src-supplier=Element14; ComponentLink3URL: https://datasheet.ciiva.com/3258/dcrcwe3-3258030.pdf?src-supplier=Avnet; ComponentLink3Description: https://datasheet.ciiva.com/3258/dcrcwe3-3258030.pdf?src-supplier=Avnet; Supplier Part Number 1: CRCW080510K0JNEB

## Sheet CompositeConnection.SchDoc
size A4; SheetNumber: 5; SheetTotal: 6
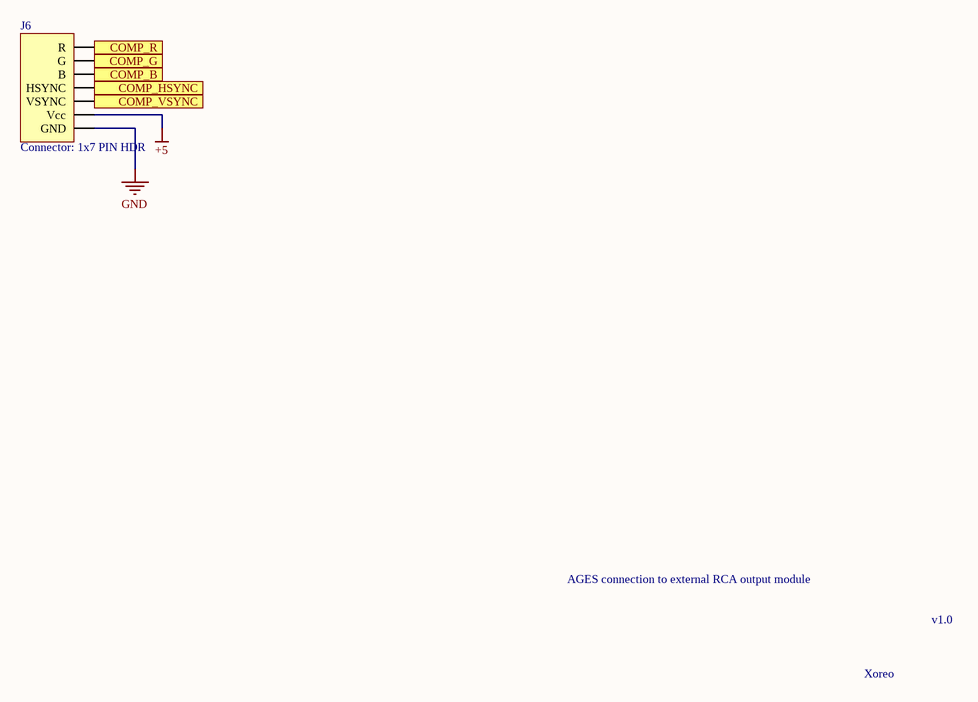
[diagram p4: CompositeConnection.SchDoc]

### Parts
J6  Connector: 1x7 PIN HDR  [7 HDR]

### Ports
COMP_B, COMP_G, COMP_HSYNC, COMP_R, COMP_VSYNC

### Nets
+5: J6.6(Vcc)
GND: J6.7(GND)
NetIC1_30: J6.1(R) ; port COMP_R
NetIC1_31: J6.2(G) ; port COMP_G
NetIC1_32: J6.3(B) ; port COMP_B
NetIC1_33: J6.5(VSYNC) ; port COMP_VSYNC
NetIC1_34: J6.4(HSYNC) ; port COMP_HSYNC

### Notes on the sheet
- AGES connection to external RCA output module
- v1.0
- Xoreo

### Library data of the parts
J6 = Connector: 1x7 PIN HDR: 7 pin header

## Sheet DebugLEDs.SchDoc
size A4; SheetNumber: 6; SheetTotal: 6
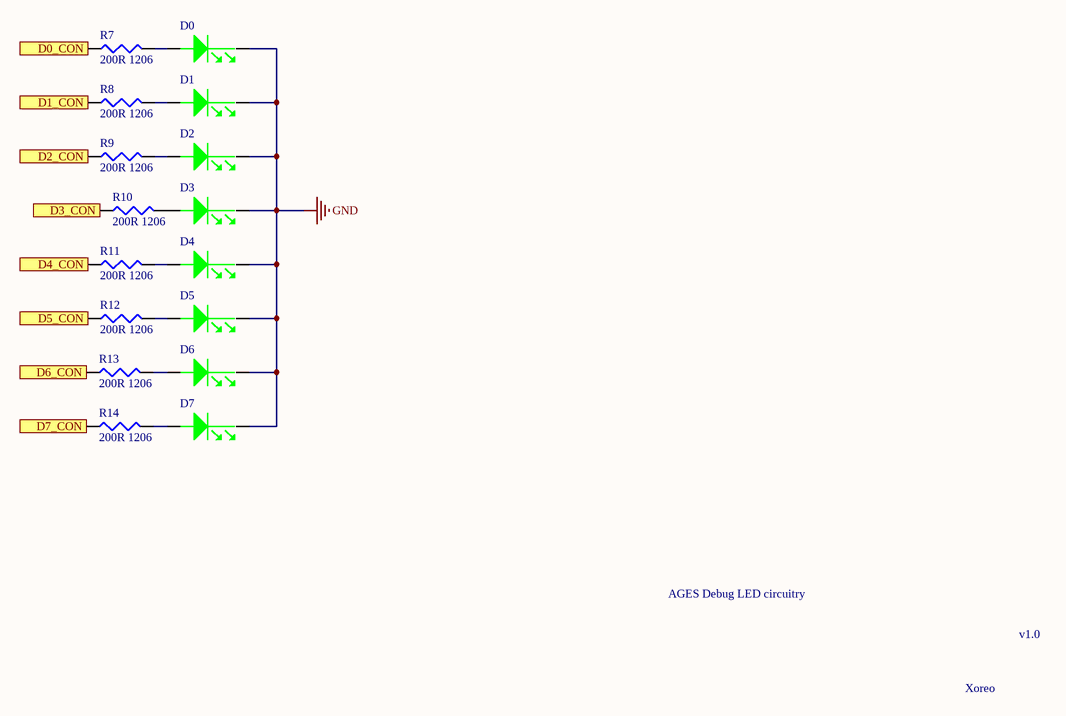
[diagram p5: DebugLEDs.SchDoc]

### Parts
D0  LEDG  [LEDC3216X120N]  (value not drawn)
D1  LEDG  [LEDC3216X120N]  (value not drawn)
D2  LEDG  [LEDC3216X120N]  (value not drawn)
D3  LEDG  [LEDC3216X120N]  (value not drawn)
D4  LEDG  [LEDC3216X120N]  (value not drawn)
D5  LEDG  [LEDC3216X120N]  (value not drawn)
D6  LEDG  [LEDC3216X120N]  (value not drawn)
D7  LEDG  [LEDC3216X120N]  (value not drawn)
R7  200R 1206  [Resistor 1206]
R8  200R 1206  [Resistor 1206]
R9  200R 1206  [Resistor 1206]
R10  200R 1206  [Resistor 1206]
R11  200R 1206  [Resistor 1206]
R12  200R 1206  [Resistor 1206]
R13  200R 1206  [Resistor 1206]
R14  200R 1206  [Resistor 1206]

### Ports
D0_CON, D1_CON, D2_CON, D3_CON, D4_CON, D5_CON, D6_CON, D7_CON

### Nets
GND: D0.NEG(+) D1.NEG(+) D2.NEG(+) D3.NEG(+) D4.NEG(+) D5.NEG(+) D6.NEG(+) D7.NEG(+)
NetD0_POS: D0.POS R7.2
NetD1_POS: D1.POS R8.2
NetD2_POS: D2.POS R9.2
NetD3_POS: D3.POS R10.2
NetD4_POS: D4.POS R11.2
NetD5_POS: D5.POS R12.2
NetD6_POS: D6.POS R13.2
NetD7_POS: D7.POS R14.2
NetIC1_15: R13.1 ; port D6_CON
NetIC1_16: R14.1 ; port D7_CON
NetIC1_18: R12.1 ; port D5_CON
NetIC1_36: R7.1 ; port D0_CON
NetIC1_38: R8.1 ; port D1_CON
NetIC1_40: R9.1 ; port D2_CON
NetIC1_42: R10.1 ; port D3_CON
NetIC1_44: R11.1 ; port D4_CON

### Notes on the sheet
- AGES Debug LED circuitry
- v1.0
- Xoreo

### Library data of the parts
D0-D7 = LED: LED Uni-Color SB. Green 565nm 2-Pin Chip LED T/R; Manufacturer: Kingbright; Manufacturer Part Number: KPT-3216SGC; Lens Color: Clear; Lens Style: Rectangular,Diffused,Colorless; Viewing Angle: 120°; Number of LEDs: 1; Luminous Intensity: 12mcd; Forward Voltage: 2.2V; Wavelength: 568nm; Forward Current: 20mA; Supplier 1: RSComponents; RoHS: Yes; Category: LEDs; Stock 1: 1; Pricing 1: 100=0,14200, 500=0,13500, 1000=0,11800, 2000=0,10700, 8000=0,10500 (USD); Mount: Surface Mount; Case/Package: 3216; Number of Pins: 2; Color: Green; Packaging: Tape and Reel; Dominant Wavelength: 568nm; Series: 1206; Radiation Hardening: No; REACH SVHC: No SVHC; RoHS Compliant: Yes; ComponentLink1URL: https://datasheet.ciiva.com/23674/1563720-23674567.pdf?src-supplier=Newark; ComponentLink1Description: https://datasheet.ciiva.com/23674/1563720-23674567.pdf?src-supplier=Newark; Supplier Part Number 1: 8610204P
R7-R14 = Resistor: 200R: Surface Mount Thick Film Resistor, AEC-Q200 ERJ Series, 200 ohm, 250 mW, - 1%, 200 V; Manufacturer: Panasonic; Manufacturer Part Number: ERJ-U08F2000V; Temperature Coefficient: 100ppm/°C; Power Rating: 250mW; Voltage Rating: 200V; Current Rating: 2A; Supplier 1: Rs; RoHS: Yes; Category: Chip SMD Resistors; Stock 1: 6900; Pricing 1: 4000=0,04900 (EUR); Case/Package: 1206; Case Code (Imperial): 1206; Case Code (Metric): 3216; Weight: 0.000571oz; Min Operating Temperature: -55°C; Max Operating Temperature: 155°C; Packaging: Tape and Reel; Resistance: 200R; Tolerance: 1%; Resistor Type: Thick Film; Series: ERJ-U08; Termination: SMD/SMT; Package Quantity: 5000; Voltage Rating (DC): 200V; Resistance Tolerance: 1%; Technology: THICK FILM; Length: 3.2mm; Width: 1.6mm; Height: 0.6mm; Depth: 1.6mm; RoHS Compliant: Yes; Reach SVHC Compliant: Yes; ComponentLink1URL: https://datasheet.ciiva.com/7891/1638979-7891542.pdf?src-supplier=Element14; ComponentLink1Description: https://datasheet.ciiva.com/7891/1638979-7891542.pdf?src-supplier=Element14; ComponentLink2URL: https://datasheet.ciiva.com/24195/ras-erj-u-267552-24195551.pdf?src-supplier=Mouser; ComponentLink2Description: https://datasheet.ciiva.com/24195/ras-erj-u-267552-24195551.pdf?src-supplier=Mouser; Supplier Part Number 1: 1723988

## Nets that join several sheets
3v: MainBoard (10 pins), RAMConnection (C1.2 IC2.32), SDConnection (10 pins)
+5: MainBoard (P2.1), CompositeConnection (J6.6)
GND: MainBoard (17 pins), RAMConnection (C1.1 IC2.16), VGAConnection (J2.11), SDConnection (5 pins), CompositeConnection (J6.7), DebugLEDs (8 pins)
NetIC1_3: MainBoard (IC1.3), RAMConnection (IC2.25)
NetIC1_5: MainBoard (IC1.5), RAMConnection (IC2.26)
NetIC1_7: MainBoard (IC1.7), RAMConnection (IC2.27)
NetIC1_15: MainBoard (IC1.15), DebugLEDs (R13.1)
NetIC1_16: MainBoard (IC1.16), DebugLEDs (R14.1)
NetIC1_18: MainBoard (IC1.18), DebugLEDs (R12.1)
NetIC1_30: MainBoard (IC1.30), CompositeConnection (J6.1)
NetIC1_31: MainBoard (IC1.31), CompositeConnection (J6.2)
NetIC1_32: MainBoard (IC1.32), CompositeConnection (J6.3)
NetIC1_33: MainBoard (IC1.33), CompositeConnection (J6.5)
NetIC1_34: MainBoard (IC1.34), CompositeConnection (J6.4)
NetIC1_36: MainBoard (IC1.36), DebugLEDs (R7.1)
NetIC1_38: MainBoard (IC1.38), DebugLEDs (R8.1)
NetIC1_40: MainBoard (IC1.40), DebugLEDs (R9.1)
NetIC1_42: MainBoard (IC1.42), DebugLEDs (R10.1)
NetIC1_44: MainBoard (IC1.44), DebugLEDs (R11.1)
NetIC1_46: MainBoard (IC1.46), SDConnection (IC3.17)
NetIC1_47: MainBoard (IC1.47), SDConnection (IC3.15)
NetIC1_48: MainBoard (IC1.48), SDConnection (IC3.16)
NetIC1_49: MainBoard (IC1.49), SDConnection (IC3.14)
NetIC1_52: MainBoard (IC1.52), VGAConnection (J2.2)
NetIC1_65: MainBoard (IC1.65), RAMConnection (IC2.31)
NetIC1_66: MainBoard (IC1.66), RAMConnection (IC2.29)
NetIC1_67: MainBoard (IC1.67), RAMConnection (IC2.2)
NetIC1_68: MainBoard (IC1.68), RAMConnection (IC2.30)
NetIC1_69: MainBoard (IC1.69), VGAConnection (J2.10)
NetIC1_74: MainBoard (IC1.74), VGAConnection (J2.8)
NetIC1_75: MainBoard (IC1.75), VGAConnection (J2.9)
NetIC1_76: MainBoard (IC1.76), VGAConnection (J2.7)
NetIC1_77: MainBoard (IC1.77), VGAConnection (J2.3)
NetIC1_78: MainBoard (IC1.78), VGAConnection (J2.6)
NetIC1_80: MainBoard (IC1.80), VGAConnection (J2.5)
NetIC1_81: MainBoard (IC1.81), VGAConnection (J2.1)
NetIC1_82: MainBoard (IC1.82), VGAConnection (J2.4)
NetIC1_89: MainBoard (IC1.89), RAMConnection (IC2.24)
NetIC1_90: MainBoard (IC1.90), RAMConnection (IC2.28)
NetIC1_91: MainBoard (IC1.91), RAMConnection (IC2.22)
NetIC1_92: MainBoard (IC1.92), RAMConnection (IC2.23)
NetIC1_93: MainBoard (IC1.93), RAMConnection (IC2.20)
NetIC1_94: MainBoard (IC1.94), RAMConnection (IC2.21)
NetIC1_95: MainBoard (IC1.95), RAMConnection (IC2.18)
NetIC1_96: MainBoard (IC1.96), RAMConnection (IC2.19)
NetIC1_97: MainBoard (IC1.97), RAMConnection (IC2.15)
NetIC1_98: MainBoard (IC1.98), RAMConnection (IC2.17)
NetIC1_99: MainBoard (IC1.99), RAMConnection (IC2.13)
NetIC1_100: MainBoard (IC1.100), RAMConnection (IC2.14)
NetIC1_101: MainBoard (IC1.101), RAMConnection (IC2.4)
NetIC1_102: MainBoard (IC1.102), RAMConnection (IC2.3)
NetIC1_103: MainBoard (IC1.103), RAMConnection (IC2.6)
NetIC1_104: MainBoard (IC1.104), RAMConnection (IC2.5)
NetIC1_105: MainBoard (IC1.105), RAMConnection (IC2.8)
NetIC1_106: MainBoard (IC1.106), RAMConnection (IC2.7)
NetIC1_107: MainBoard (IC1.107), RAMConnection (IC2.10)
NetIC1_108: MainBoard (IC1.108), RAMConnection (IC2.9)
NetIC1_109: MainBoard (IC1.109), RAMConnection (IC2.12)
NetIC1_110: MainBoard (IC1.110), RAMConnection (IC2.11)